# Altium schematic sheet [03] - MacroPad.SchDoc
size A4; DocumentNumber: 3; SheetNumber: 3; SheetTotal: 6
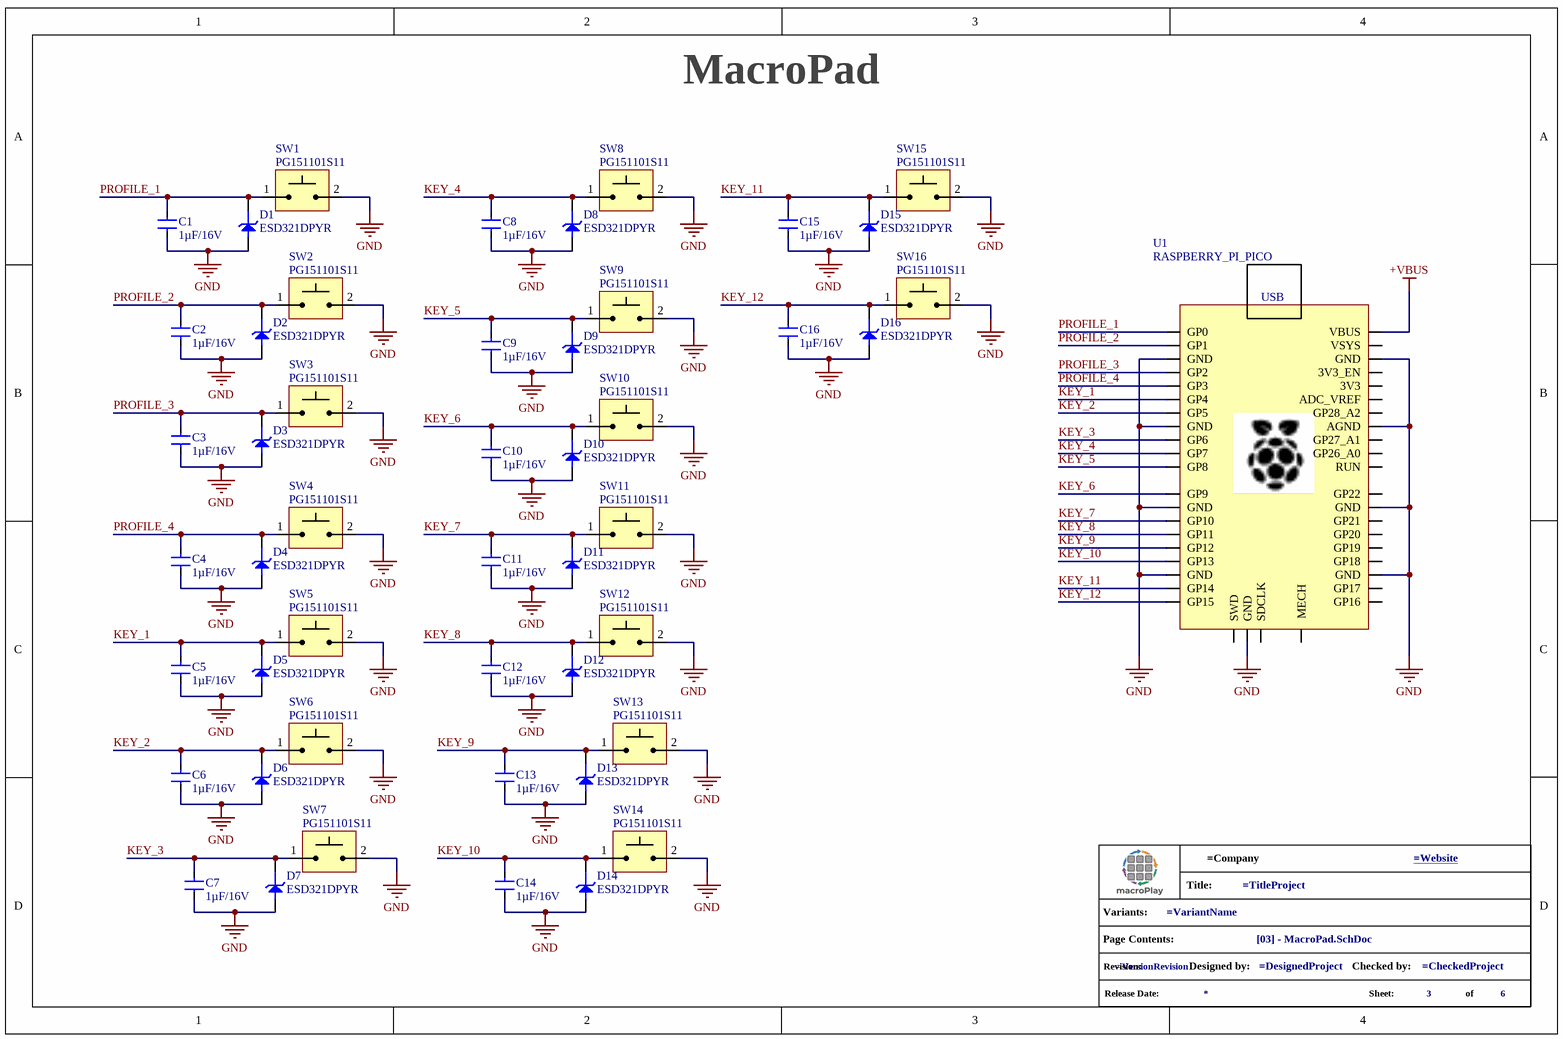
[diagram p0: [03] - MacroPad.SchDoc]

## Parts
*?  info_project  (value not drawn)  (graphical)
C1  1µF/16V  [C0402]
C2  1µF/16V  [C0402]
C3  1µF/16V  [C0402]
C4  1µF/16V  [C0402]
C5  1µF/16V  [C0402]
C6  1µF/16V  [C0402]
C7  1µF/16V  [C0402]
C8  1µF/16V  [C0402]
C9  1µF/16V  [C0402]
C10  1µF/16V  [C0402]
C11  1µF/16V  [C0402]
C12  1µF/16V  [C0402]
C13  1µF/16V  [C0402]
C14  1µF/16V  [C0402]
C15  1µF/16V  [C0402]
C16  1µF/16V  [C0402]
D1  ESD321DPYR  [ESD321DPYR]
D2  ESD321DPYR  [ESD321DPYR]
D3  ESD321DPYR  [ESD321DPYR]
D4  ESD321DPYR  [ESD321DPYR]
D5  ESD321DPYR  [ESD321DPYR]
D6  ESD321DPYR  [ESD321DPYR]
D7  ESD321DPYR  [ESD321DPYR]
D8  ESD321DPYR  [ESD321DPYR]
D9  ESD321DPYR  [ESD321DPYR]
D10  ESD321DPYR  [ESD321DPYR]
D11  ESD321DPYR  [ESD321DPYR]
D12  ESD321DPYR  [ESD321DPYR]
D13  ESD321DPYR  [ESD321DPYR]
D14  ESD321DPYR  [ESD321DPYR]
D15  ESD321DPYR  [ESD321DPYR]
D16  ESD321DPYR  [ESD321DPYR]
SW1  PG151101S11  [SW_PG151101S11]
SW2  PG151101S11  [SW_PG151101S11]
SW3  PG151101S11  [SW_PG151101S11]
SW4  PG151101S11  [SW_PG151101S11]
SW5  PG151101S11  [SW_PG151101S11]
SW6  PG151101S11  [SW_PG151101S11]
SW7  PG151101S11  [SW_PG151101S11]
SW8  PG151101S11  [SW_PG151101S11]
SW9  PG151101S11  [SW_PG151101S11]
SW10  PG151101S11  [SW_PG151101S11]
SW11  PG151101S11  [SW_PG151101S11]
SW12  PG151101S11  [SW_PG151101S11]
SW13  PG151101S11  [SW_PG151101S11]
SW14  PG151101S11  [SW_PG151101S11]
SW15  PG151101S11  [SW_PG151101S11]
SW16  PG151101S11  [SW_PG151101S11]
U1  RASPBERRY_PI_PICO  [RASPBERRY_PI_PICO]

## Nets
+VBUS: U1.VBUS
GND: C1.1 C2.1 C3.1 C4.1 C5.1 C6.1 C7.1 C8.1 C9.1 C10.1 C11.1 C12.1 C13.1 C14.1 C15.1 C16.1 D1.2 D2.2 D3.2 D4.2 D5.2 D6.2 D7.2 D8.2 D9.2 D10.2 D11.2 D12.2 D13.2 D14.2 D15.2 D16.2 SW1.2 SW2.2 SW3.2 SW4.2 SW5.2 SW6.2 SW7.2 SW8.2 SW9.2 SW10.2 SW11.2 SW12.2 SW13.2 SW14.2 SW15.2 SW16.2 U1.AGND U1.GND
KEY_1: C5.2 D5.1 SW5.1 U1.GP4
KEY_2: C6.2 D6.1 SW6.1 U1.GP5
KEY_3: C7.2 D7.1 SW7.1 U1.GP6
KEY_4: C8.2 D8.1 SW8.1 U1.GP7
KEY_5: C9.2 D9.1 SW9.1 U1.GP8
KEY_6: C10.2 D10.1 SW10.1 U1.GP9
KEY_7: C11.2 D11.1 SW11.1 U1.GP10
KEY_8: C12.2 D12.1 SW12.1 U1.GP11
KEY_9: C13.2 D13.1 SW13.1 U1.GP12
KEY_10: C14.2 D14.1 SW14.1 U1.GP13
KEY_11: C15.2 D15.1 SW15.1 U1.GP14
KEY_12: C16.2 D16.1 SW16.1 U1.GP15
PROFILE_1: C1.2 D1.1 SW1.1 U1.GP0
PROFILE_2: C2.2 D2.1 SW2.1 U1.GP1
PROFILE_3: C3.2 D3.1 SW3.1 U1.GP2
PROFILE_4: C4.2 D4.1 SW4.1 U1.GP3

Not connected (* = marked no-connect by the designer): U1 3V3 3V3_EN ADC_VREF GP16 GP17 GP18 GP19 GP20 GP21 GP22 GP26_A0 GP27_A1 GP28_A2 MECH RUN SDCLK SWD VSYS

## Notes on the sheet
- MacroPad
- (in symbol info_project) Title:; Variants:; Page Contents:; Revision:; Designed by:; Checked by:; Release Date:; Sheet:; of
- (in symbol RASPBERRY_PI_PICO) USB

## Library data of the parts
*? = info_project: GRAPHICAL - Info Project
C1-C16 = EMK105BJ105KV-F: MLCC - 1µF 16V 0402 X5R ±10%.; Manufacturer 1: Taiyo Yuden; Dielectric Material: Ceramic; Value: 1uF; Multilayer: Yes; Tolerance  (fill in as +-): 10%; .Mounting: SMT; Supplier 1: Avnet; Supplier Part Number 1: 84R9109; Manufacturer Part Number 1: EMK105BJ105KV-F; RoHS: Yes; Category: Ceramic Capacitors; Stock: 100000; Pricing: 10000=0,007, 20000=0,008 (USD); Mounting Technology: Surface Mount; Pins: 2; Package Shape: Rectangular; Case/Package: 0402; Terminal Finish: Nickel; Min Operating Temperature: -55°C; Max Operating Temperature: 85°C; JESD-609 Code: e3; Capacitor Type: Ceramic; Package Style: SMTMeter; Packaging: Tape and Reel; Tolerance (fill in as +-): 10%; Rated DC Voltage (URdc): 16V; Temperature Characteristics Code: X5R; Termination: Wraparound; Length: 1mm; Width: 0.5mm; Height: 0.5mm; Reach SVHC Compliant: Yes; RoHS Compliant: Yes; ComponentLink1URL: https://datasheet.ciiva.com:443/pdfs/VipMasterIC/IC/TAIY/TAIY-S-A0009096450/TAIY-S-A0009096597-1.pdf?src-supplier=IHS+Markit; ComponentLink1Description: https://datasheet.ciiva.com:443/pdfs/VipMasterIC/IC/TAIY/TAIY-S-A0009096450/TAIY-S-A0009096597-1.pdf?src-supplier=IHS+Markit; ComponentLink2URL: https://datasheet.ciiva.com/134/emk105bj105kv-f-ss-134209.pdf?src-supplier=Digikey; ComponentLink2Description: https://datasheet.ciiva.com/134/emk105bj105kv-f-ss-134209.pdf?src-supplier=Digikey; ComponentLink3URL: https://datasheet.ciiva.com/30259/265emk105bj105kv-f-30259872.pdf?src-supplier=Onlinecomponents.com; ComponentLink3Description: https://datasheet.ciiva.com/30259/265emk105bj105kv-f-30259872.pdf?src-supplier=Onlinecomponents.com; ComponentLink4URL: https://datasheet.ciiva.com/15920/964emk105bj105kv-f-15920402.pdf?src-supplier=Onlinecomponents.com; ComponentLink4Description: https://datasheet.ciiva.com/15920/964emk105bj105kv-f-15920402.pdf?src-supplier=Onlinecomponents.com; ComponentLink5URL: https://datasheet.ciiva.com/26871/getdatasheetpartid-638287-26871289.pdf?src-supplier=Verical; ComponentLink5Description: https://datasheet.ciiva.com/26871/getdatasheetpartid-638287-26871289.pdf?src-supplier=Verical; ComponentLink6URL: https://datasheet.ciiva.com/5424/mlcc01-e-5424190.pdf?src-supplier=Mouser; ComponentLink6Description: https://datasheet.ciiva.com/5424/mlcc01-e-5424190.pdf?src-supplier=Mouser; ComponentLink7URL: https://datasheet.ciiva.com/22694/1497285-22694239.pdf?src-supplier=Element14; ComponentLink7Description: https://datasheet.ciiva.com/22694/1497285-22694239.pdf?src-supplier=Element14; ComponentLink8URL: https://datasheet.ciiva.com/7657/1497285-7657320.pdf?src-supplier=Element14; ComponentLink8Description: https://datasheet.ciiva.com/7657/1497285-7657320.pdf?src-supplier=Element14; .PCBChecked: *; .SCHChecked: *
D1-D16 = ESD321DPYR: DIODE - TVS UNI-DIR 3.6V, 4.5V, 6.8V, 6A, 0.9pF.; Manufacturer 1: Texas Instruments; Description 1: ESD Suppressor Diode TVS Uni-Dir 3.6V 2-Pin X1SON T/R; Category 1: TVS Diodes; .Mouting: SMT; .SCHChecked: Lucas Vieira; RoHS Compliant: Yes; ComponentLink1URL: http://www.ti.com/general/docs/suppproductinfo.tsp?distId=10&amp;gotoUrl=http%3A%2F%2Fwww.ti.com%2Flit%2Fgpn%2Fesd321&src-supplier=Digi-Key; ComponentLink1Description: http://www.ti.com/general/docs/suppproductinfo.tsp?distId=10&amp;gotoUrl=http%3A%2F%2Fwww.ti.com%2Flit%2Fgpn%2Fesd321&src-supplier=Digi-Key; Supplier 1: Digi-Key; Supplier Part Number 1: 296-51108-1-ND; Manufacturer Part Number 1: ESD321DPYR; RoHS 1: Yes; Stock 1: 172519; Pricing 1: 1=0,37000, 10=0,29900, 100=0,20350, 500=0,15264, 1000=0,11448, 2000=0,10494, 5000=0,09858 (USD); Manufacturer 2: Texas Instruments; Manufacturer Part Number 2: ESD351DPYR; .PCBChecked: Lucas Vieira; Manufacturer 3: Panjit International Inc.; Manufacturer Part Number 3: PE1605M1Q_R1_00001; .Mounting: SMT
SW1-SW16 = PG151101S11: SWITCH - Kailh socket for hotswap mechanical switches; .Mounting: SMD; SnapEDA_Link: https://www.snapeda.com/parts/PG151101S11/Kailh/view-part/?ref=snap; Package: Package; Value: *; MF: Kailh; MP: PG151101S11; Check_prices: https://www.snapeda.com/parts/PG151101S11/Kailh/view-part/?ref=eda; .PCBChecked: *; .SCHChecked: *
U1 = RASPBERRY_PI_PICO: MCU Module - Raspberry Pi Board, Arm Cortex-M0+; Core Architecture:Arm; Core Sub-Architecture:Cortex-M0+; Kit Contents:Raspberry Pi Pico Board; No. Of Bits:32Bit; Silicon Core Number:Rp2040; Silicon Manufacturer:Raspberry Pi |Raspberry-Pi RASPBERRY PI PICO; .Mounting: SMD or PTH variant; SnapEDA_Link: https://www.snapeda.com/parts/RASPBERRY%20PI%20PICO/Raspberry+Pi/view-part/?ref=snap; Package: None; Value: *; MF: Raspberry Pi; MP: RASPBERRY PI PICO; Check_prices: https://www.snapeda.com/parts/RASPBERRY%20PI%20PICO/Raspberry+Pi/view-part/?ref=eda; .PCBChecked: *; .SCHChecked: *